# EAGLE design Fan-Controller (EAGLE 9.6.2)
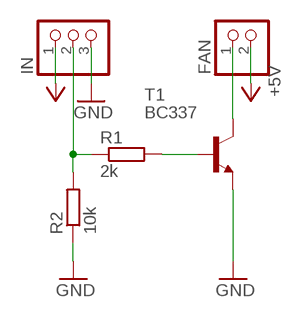
[diagram p0: schematic, sheet 1]

## Parts
FAN  PINHD-1X2/90  [1X02/90]
IN  PINHD-1X3/90  [1X03/90]
R1  2k  R-EU_0204/7  [0204/7]
R2  10k  R-EU_0204/7  [0204/7]
T1  BC337  [TO92]

## Nets
+5V: FAN.2 IN.1
GND: IN.3 R2.1 T1.1(E)
N$1: FAN.1 T1.3(C)
N$2: R1.2 T1.2(B)
N$3: IN.2 R1.1 R2.2

## Library data of the parts
FAN = pinhead:PINHD-1X2: PIN HEADER
IN = pinhead:PINHD-1X3: PIN HEADER
R1 R2 = rcl:R-EU_: RESISTOR, European symbol; SPICEPREFIX: R
T1 = transistor:BC337: NPN TRANSISTOR

## Board
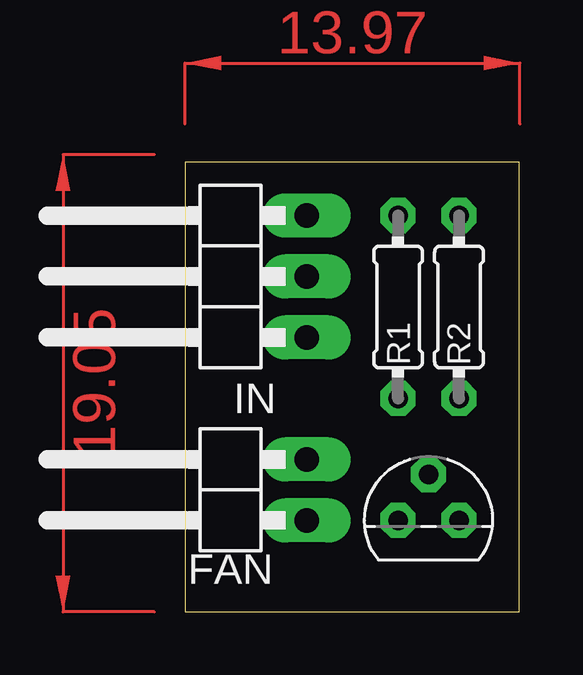
[diagram p1: board, top side]
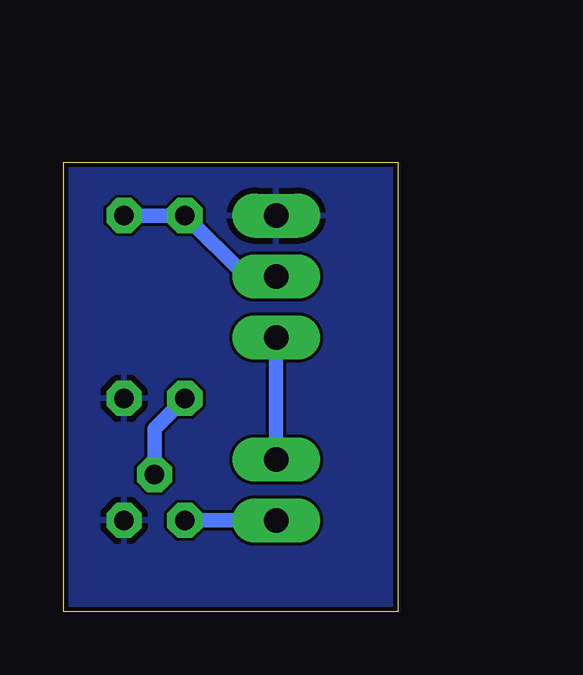
[diagram p2: board, bottom side, seen from below]

Size 13.95 x 18.72 mm. Coordinates in mm from the lower left corner, seen from the top.
Outline: 0,0 13.95,0 13.95,18.72 0,18.72 0,0
Copper layers (1*16): Top 0.035mm / dielectric 1.6mm / Bottom 0.035mm
Design rules "jlcpcb-2layers": minimum track width 5mil, minimum drill 0.3mm, track to track 5mil, track to pad 5mil, pad to pad 5mil, via to via 5mil, smd to smd 5mil, copper to edge 0.2mm, drill to drill 6mil, minimum pad ring 10mil, minimum via ring 3mil, stop-mask expansion 4mil, vias tented up to drill 0mil, thermal gap 10mil

### Footprints (pad centres in the part's own frame; a part is rotated, then mirrored left to right if it is on the bottom)
1X02/90 = drill 1.016 long: 1 -1.27,-3.81; 2 1.27,-3.81
1X03/90 = drill 1.016 long: 1 -2.54,-3.81; 2 0,-3.81; 3 2.54,-3.81
0204/7 = drill 0.813 octagon: 1 -3.81,0; 2 3.81,0
TO92 = drill 0.813 octagon: 1 1.27,0; 2 0,1.905; 3 -1.27,0

### Placement (x,y rotation side)
FAN  1.27,5.08 90 top
IN  1.27,13.97 90 top
R1  8.89,12.7 270 top
R2  11.43,12.7 90 top
T1  10.16,3.81 0 top

### Tracks (layer width: path | path; a pad name or v marks a point on that pad's centre or on a via)
+5V
  Bottom 0.61: IN.1 FAN.2
GND
  pour Bottom: 0,19.05 13.97,19.05 13.97,0 0,0
N$1
  Bottom 0.61: T1.3 FAN.1
N$2
  Bottom 0.61: R1.2 10.16,7.62 T1.2
N$3
  Bottom 0.61: IN.2 6.35,13.97 R1.1 R2.2
(copper drawn outside any net)
  shapes: Top area x2